# EAGLE design ai_breakout_rpi_rshaped (EAGLE 7.1.0)
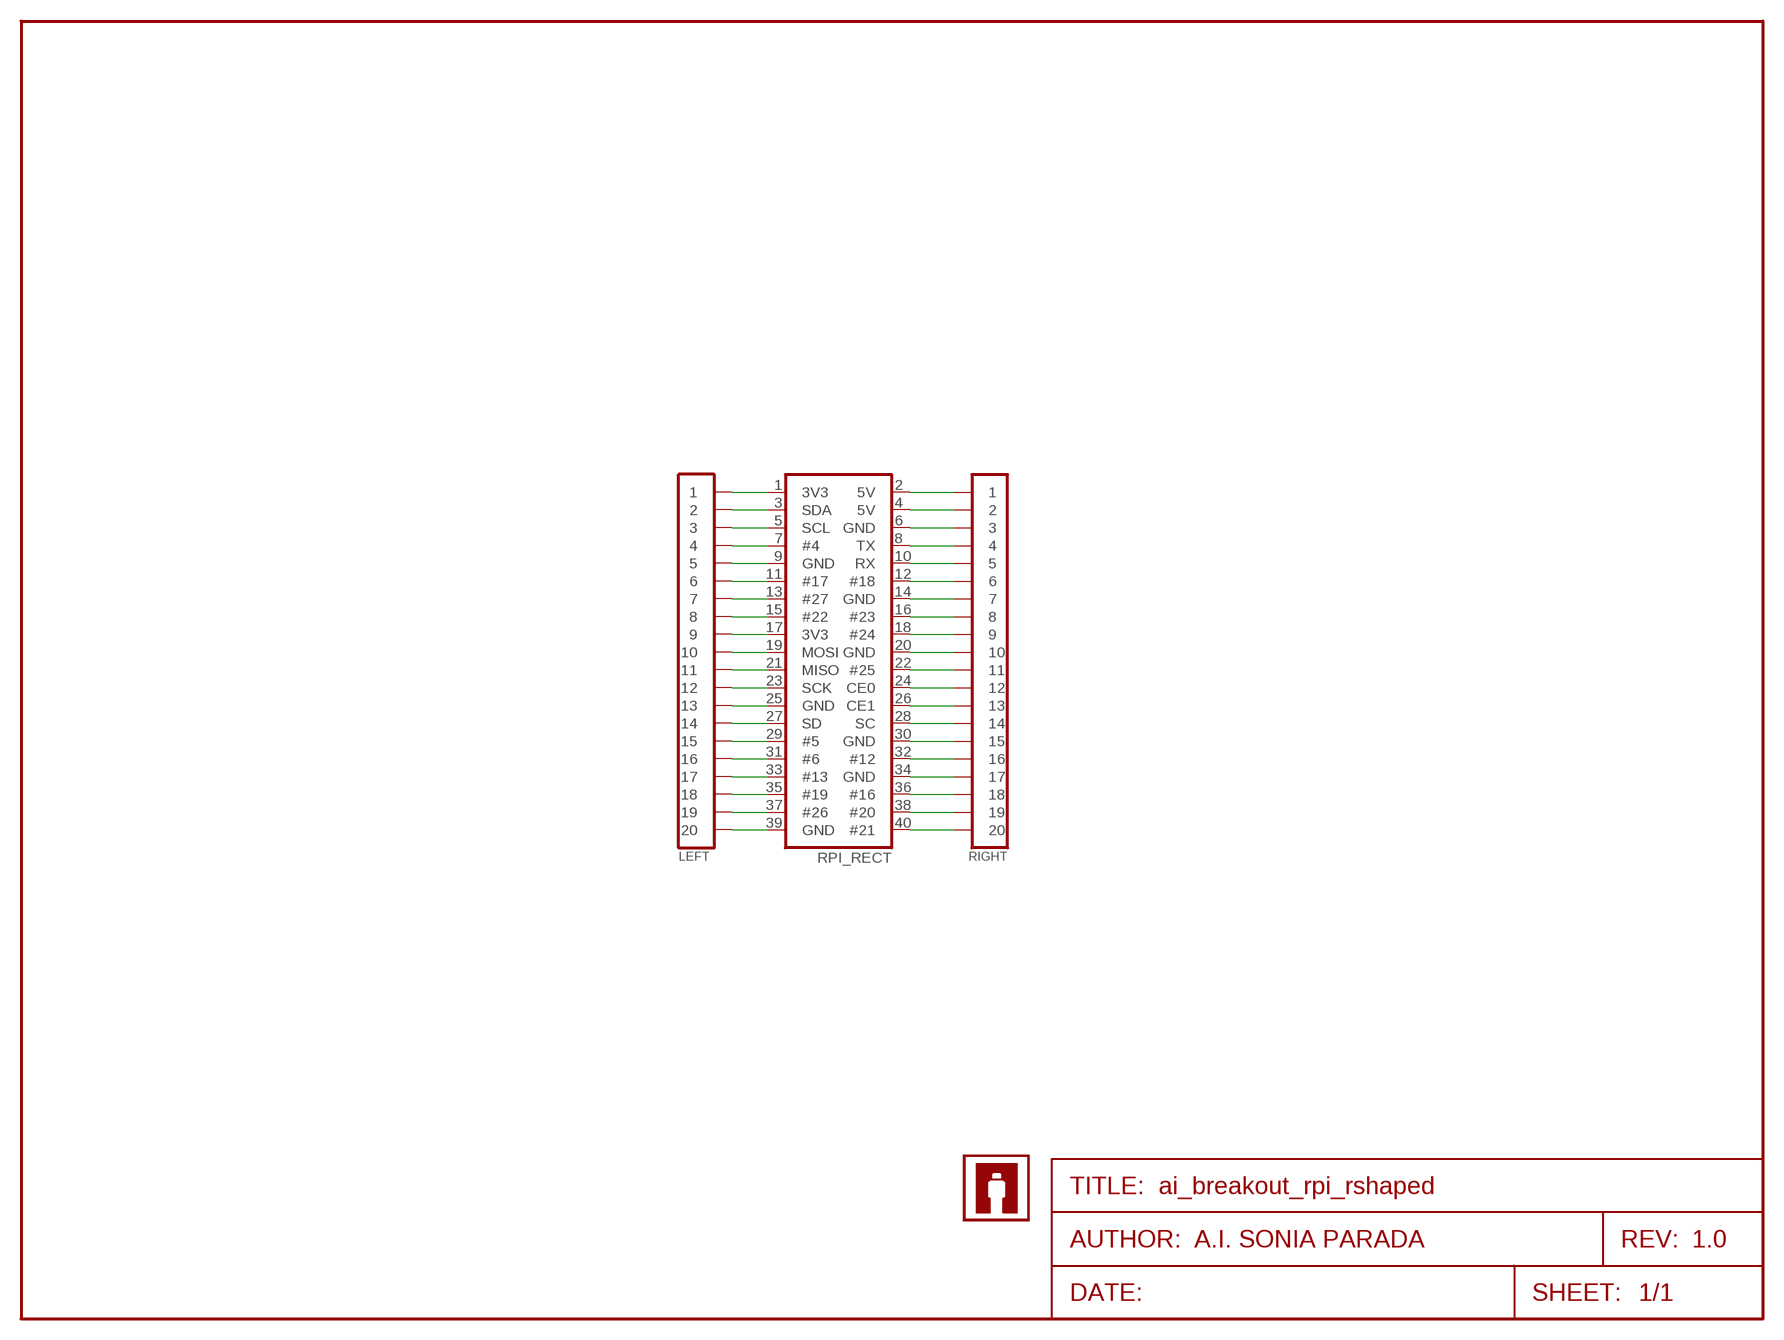
[diagram p0: schematic, sheet 1]
FRAME1 (FRAME-LETTER): AUTHOR: A.I. SONIA PARADA; REV: 1.0

## Parts
LEFT  1X20  [1X20]
RIGHT  1X20NOFIRST  [1X20-NOFIRST]
RPI_RECT  2X20-RPI-BRK  [2X20-RPI-BRK]
U$1  AI-LOGOXS  [AI-LOGO-XS]
U$2  AI-LOGOXS  [AI-LOGO-XS]

## Nets
N$1: LEFT.1 RPI_RECT.1(3V3)
N$2: LEFT.2 RPI_RECT.3(SDA)
N$3: LEFT.3 RPI_RECT.5(SCL)
N$4: LEFT.4 RPI_RECT.7(#4)
N$5: LEFT.5 RPI_RECT.9(GND)
N$6: LEFT.6 RPI_RECT.11(#17)
N$7: LEFT.7 RPI_RECT.13(#27)
N$8: LEFT.8 RPI_RECT.15(#22)
N$9: LEFT.9 RPI_RECT.17(3V3)
N$10: LEFT.10 RPI_RECT.19(MOSI)
N$11: LEFT.11 RPI_RECT.21(MISO)
N$12: LEFT.12 RPI_RECT.23(SCK)
N$13: LEFT.13 RPI_RECT.25(GND)
N$14: LEFT.14 RPI_RECT.27(SD)
N$15: LEFT.15 RPI_RECT.29(#5)
N$16: LEFT.16 RPI_RECT.31(#6)
N$17: LEFT.17 RPI_RECT.33(#13)
N$18: LEFT.18 RPI_RECT.35(#19)
N$19: LEFT.19 RPI_RECT.37(#26)
N$20: LEFT.20 RPI_RECT.39(GND)
N$21: RIGHT.20 RPI_RECT.40(#21)
N$22: RIGHT.19 RPI_RECT.38(#20)
N$23: RIGHT.18 RPI_RECT.36(#16)
N$24: RIGHT.17 RPI_RECT.34(GND)
N$25: RIGHT.16 RPI_RECT.32(#12)
N$26: RIGHT.15 RPI_RECT.30(GND)
N$27: RIGHT.14 RPI_RECT.28(SC)
N$28: RIGHT.13 RPI_RECT.26(CE1)
N$29: RIGHT.12 RPI_RECT.24(CE0)
N$30: RIGHT.11 RPI_RECT.22(#25)
N$31: RIGHT.10 RPI_RECT.20(GND)
N$32: RIGHT.9 RPI_RECT.18(#24)
N$33: RIGHT.8 RPI_RECT.16(#23)
N$34: RIGHT.7 RPI_RECT.14(GND)
N$35: RIGHT.6 RPI_RECT.12(#18)
N$36: RIGHT.5 RPI_RECT.10(RX)
N$37: RIGHT.4 RPI_RECT.8(TX)
N$38: RIGHT.3 RPI_RECT.6(GND)
N$39: RIGHT.2 RPI_RECT.4(5V)
N$40: RIGHT.1 RPI_RECT.2(5V)

## Library data of the parts
LEFT RIGHT = Ai_Connectors:1X20
RPI_RECT = Ai_Connectors:2X20-RPI
U$1 U$2 = Ai_Miscellany:AI-LOGO

## Board
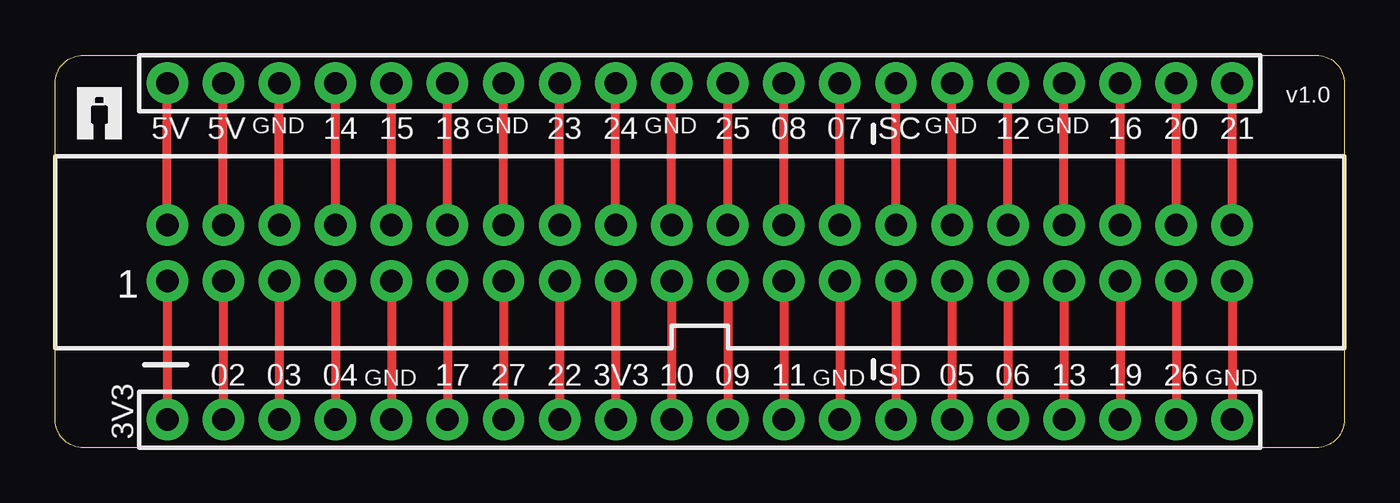
[diagram p1: board, top side]
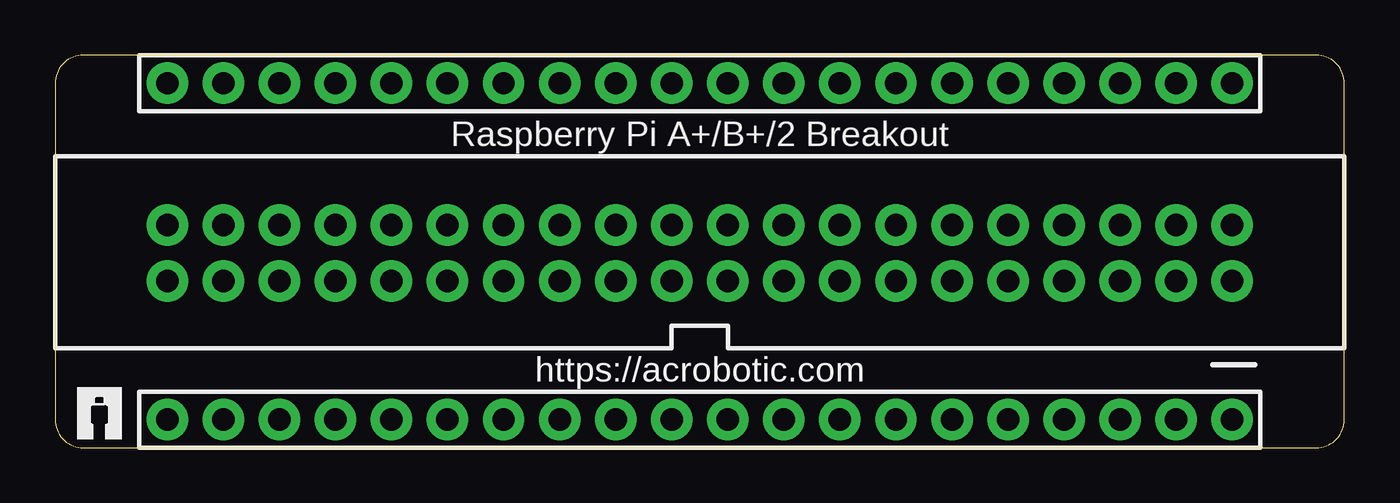
[diagram p2: board, bottom side, seen from below]

Size 58.42 x 17.78 mm. Coordinates in mm from the lower left corner, seen from the top.
Outline: 1.27,17.78 57.15,17.78 arc-90 58.42,16.51 58.42,1.27 arc-90 57.15,0 1.27,0 arc-90 0,1.27 0,16.51 arc-90 1.27,17.78
Copper layers (1*16): Top 0.035mm / dielectric 1.5mm / Bottom 0.035mm
Design rules "ai_2layer": minimum track width 7mil, minimum drill 15mil, track to track 8mil, track to pad 8mil, pad to pad 8mil, via to via 8mil, smd to smd 8mil, copper to edge 8mil, drill to drill 8mil, minimum pad ring 12mil, minimum via ring 10mil, stop-mask expansion 4mil, vias tented up to drill 20mil, thermal gap 10mil

### Footprints (pad centres in the part's own frame; a part is rotated, then mirrored left to right if it is on the bottom)
1X20 = drill 1.016 pad 1.88: 1 -24.13,0; 2 -21.59,0; 3 -19.05,0; 4 -16.51,0; 5 -13.97,0; 6 -11.43,0; 7 -8.89,0; 8 -6.35,0; 9 -3.81,0; 10 -1.27,0; 11 1.27,0; 12 3.81,0; 13 6.35,0; 14 8.89,0; 15 11.43,0; 16 13.97,0; 17 16.51,0; 18 19.05,0; 19 21.59,0; 20 24.13,0
1X20-NOFIRST = drill 1.016 pad 1.88: 1 -24.13,0; 2 -21.59,0; 3 -19.05,0; 4 -16.51,0; 5 -13.97,0; 6 -11.43,0; 7 -8.89,0; 8 -6.35,0; 9 -3.81,0; 10 -1.27,0; 11 1.27,0; 12 3.81,0; 13 6.35,0; 14 8.89,0; 15 11.43,0; 16 13.97,0; 17 16.51,0; 18 19.05,0; 19 21.59,0; 20 24.13,0
2X20-RPI-BRK = drill 1.016 pad 1.88: 1 -24.13,-1.27; 2 -24.13,1.27; 3 -21.59,-1.27; 4 -21.59,1.27; 5 -19.05,-1.27; 6 -19.05,1.27; 7 -16.51,-1.27; 8 -16.51,1.27; 9 -13.97,-1.27; 10 -13.97,1.27; 11 -11.43,-1.27; 12 -11.43,1.27; 13 -8.89,-1.27; 14 -8.89,1.27; 15 -6.35,-1.27; 16 -6.35,1.27; 17 -3.81,-1.27; 18 -3.81,1.27; 19 -1.27,-1.27; 20 -1.27,1.27; 21 1.27,-1.27; 22 1.27,1.27; 23 3.81,-1.27; 24 3.81,1.27; 25 6.35,-1.27; 26 6.35,1.27; 27 8.89,-1.27; 28 8.89,1.27; 29 11.43,-1.27; 30 11.43,1.27; 31 13.97,-1.27; 32 13.97,1.27; 33 16.51,-1.27; 34 16.51,1.27; 35 19.05,-1.27; 36 19.05,1.27; 37 21.59,-1.27; 38 21.59,1.27; 39 24.13,-1.27; 40 24.13,1.27

### Placement (x,y rotation side)
LEFT  29.21,1.27 0 top
RIGHT  29.21,16.51 0 top
RPI_RECT  29.21,8.83 0 top
U$1  1.02,13.97 0 top
U$2  57.4,0.38 0 bottom

### Tracks (layer width: path | path; a pad name or v marks a point on that pad's centre or on a via)
N$1
  Top 0.406: RPI_RECT.1 LEFT.1
N$2
  Top 0.406: RPI_RECT.3 LEFT.2
N$3
  Top 0.406: RPI_RECT.5 LEFT.3
N$4
  Top 0.406: RPI_RECT.7 LEFT.4
N$5
  Top 0.406: RPI_RECT.9 LEFT.5
N$6
  Top 0.406: RPI_RECT.11 LEFT.6
N$7
  Top 0.406: RPI_RECT.13 LEFT.7
N$8
  Top 0.406: RPI_RECT.15 LEFT.8
N$9
  Top 0.406: RPI_RECT.17 LEFT.9
N$10
  Top 0.406: RPI_RECT.19 LEFT.10
N$11
  Top 0.406: RPI_RECT.21 LEFT.11
N$12
  Top 0.406: RPI_RECT.23 LEFT.12
N$13
  Top 0.406: RPI_RECT.25 LEFT.13
N$14
  Top 0.406: RPI_RECT.27 LEFT.14
N$15
  Top 0.406: RPI_RECT.29 LEFT.15
N$16
  Top 0.406: RPI_RECT.31 LEFT.16
N$17
  Top 0.406: RPI_RECT.33 LEFT.17
N$18
  Top 0.406: RPI_RECT.35 LEFT.18
N$19
  Top 0.406: RPI_RECT.37 LEFT.19
N$20
  Top 0.406: RPI_RECT.39 LEFT.20
N$21
  Top 0.406: RPI_RECT.40 RIGHT.20
N$22
  Top 0.406: RPI_RECT.38 RIGHT.19
N$23
  Top 0.406: RPI_RECT.36 RIGHT.18
N$24
  Top 0.406: RPI_RECT.34 RIGHT.17
N$25
  Top 0.406: RPI_RECT.32 RIGHT.16
N$26
  Top 0.406: RPI_RECT.30 RIGHT.15
N$27
  Top 0.406: RPI_RECT.28 RIGHT.14
N$28
  Top 0.406: RPI_RECT.26 RIGHT.13
N$29
  Top 0.406: RPI_RECT.24 RIGHT.12
N$30
  Top 0.406: RPI_RECT.22 RIGHT.11
N$31
  Top 0.406: RPI_RECT.20 RIGHT.10
N$32
  Top 0.406: RPI_RECT.18 RIGHT.9
N$33
  Top 0.406: RPI_RECT.16 RIGHT.8
N$34
  Top 0.406: RPI_RECT.14 RIGHT.7
N$35
  Top 0.406: RPI_RECT.12 RIGHT.6
N$36
  Top 0.406: RPI_RECT.10 RIGHT.5
N$37
  Top 0.406: RPI_RECT.8 RIGHT.4
N$38
  Top 0.406: RPI_RECT.6 RIGHT.3
N$39
  Top 0.406: RPI_RECT.4 RIGHT.2
N$40
  Top 0.406: RPI_RECT.2 RIGHT.1

### Text on the board
tPlace: v1.0 | 5V | 5V | GND | 14 | 15 | 18 | GND | 23 | 24 | GND | 25 | 08 | 07 | SC | GND | 12 | GND | 16 | 20 | 21 | 02 | 03 | 04 | GND | 17 | 27 | 22 | 3V3 | 10 | 09 | 11 | GND | SD | 05 | 06 | 13 | 19 | 26 | GND | 3V3
bPlace: Raspberry Pi A+/B+/2 Breakout | https://acrobotic.com